# Altium schematic sheet Earth_Connectors.SchDoc
size A; SheetNumber: 3; SheetTotal: 9
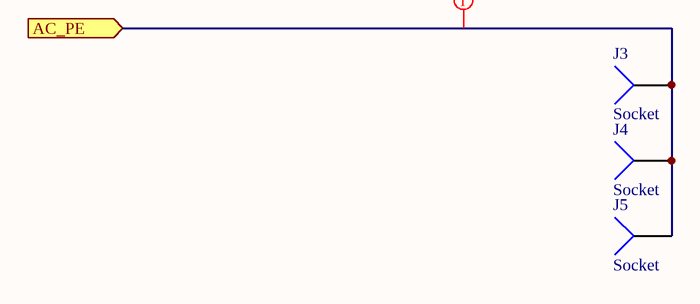
[diagram p0: Earth_Connectors.SchDoc]

## Parts
J3  Socket  [PIN1]
J4  Socket  [PIN1]
J5  Socket  [PIN1]

## Ports
AC_PE (in)

## Nets
AC_PE: J3.1 J4.1 J5.1 ; port AC_PE

## Layout directives
net class PE_NETS: AC_PE

## Library data of the parts
J3-J5 = Socket: LatestRevisionDate: 17-Jul-2002; LatestRevisionNote: Re-released for DXP Platform.; Publisher: Altium Limited